# EAGLE design control_driver (EAGLE 7.5.0)
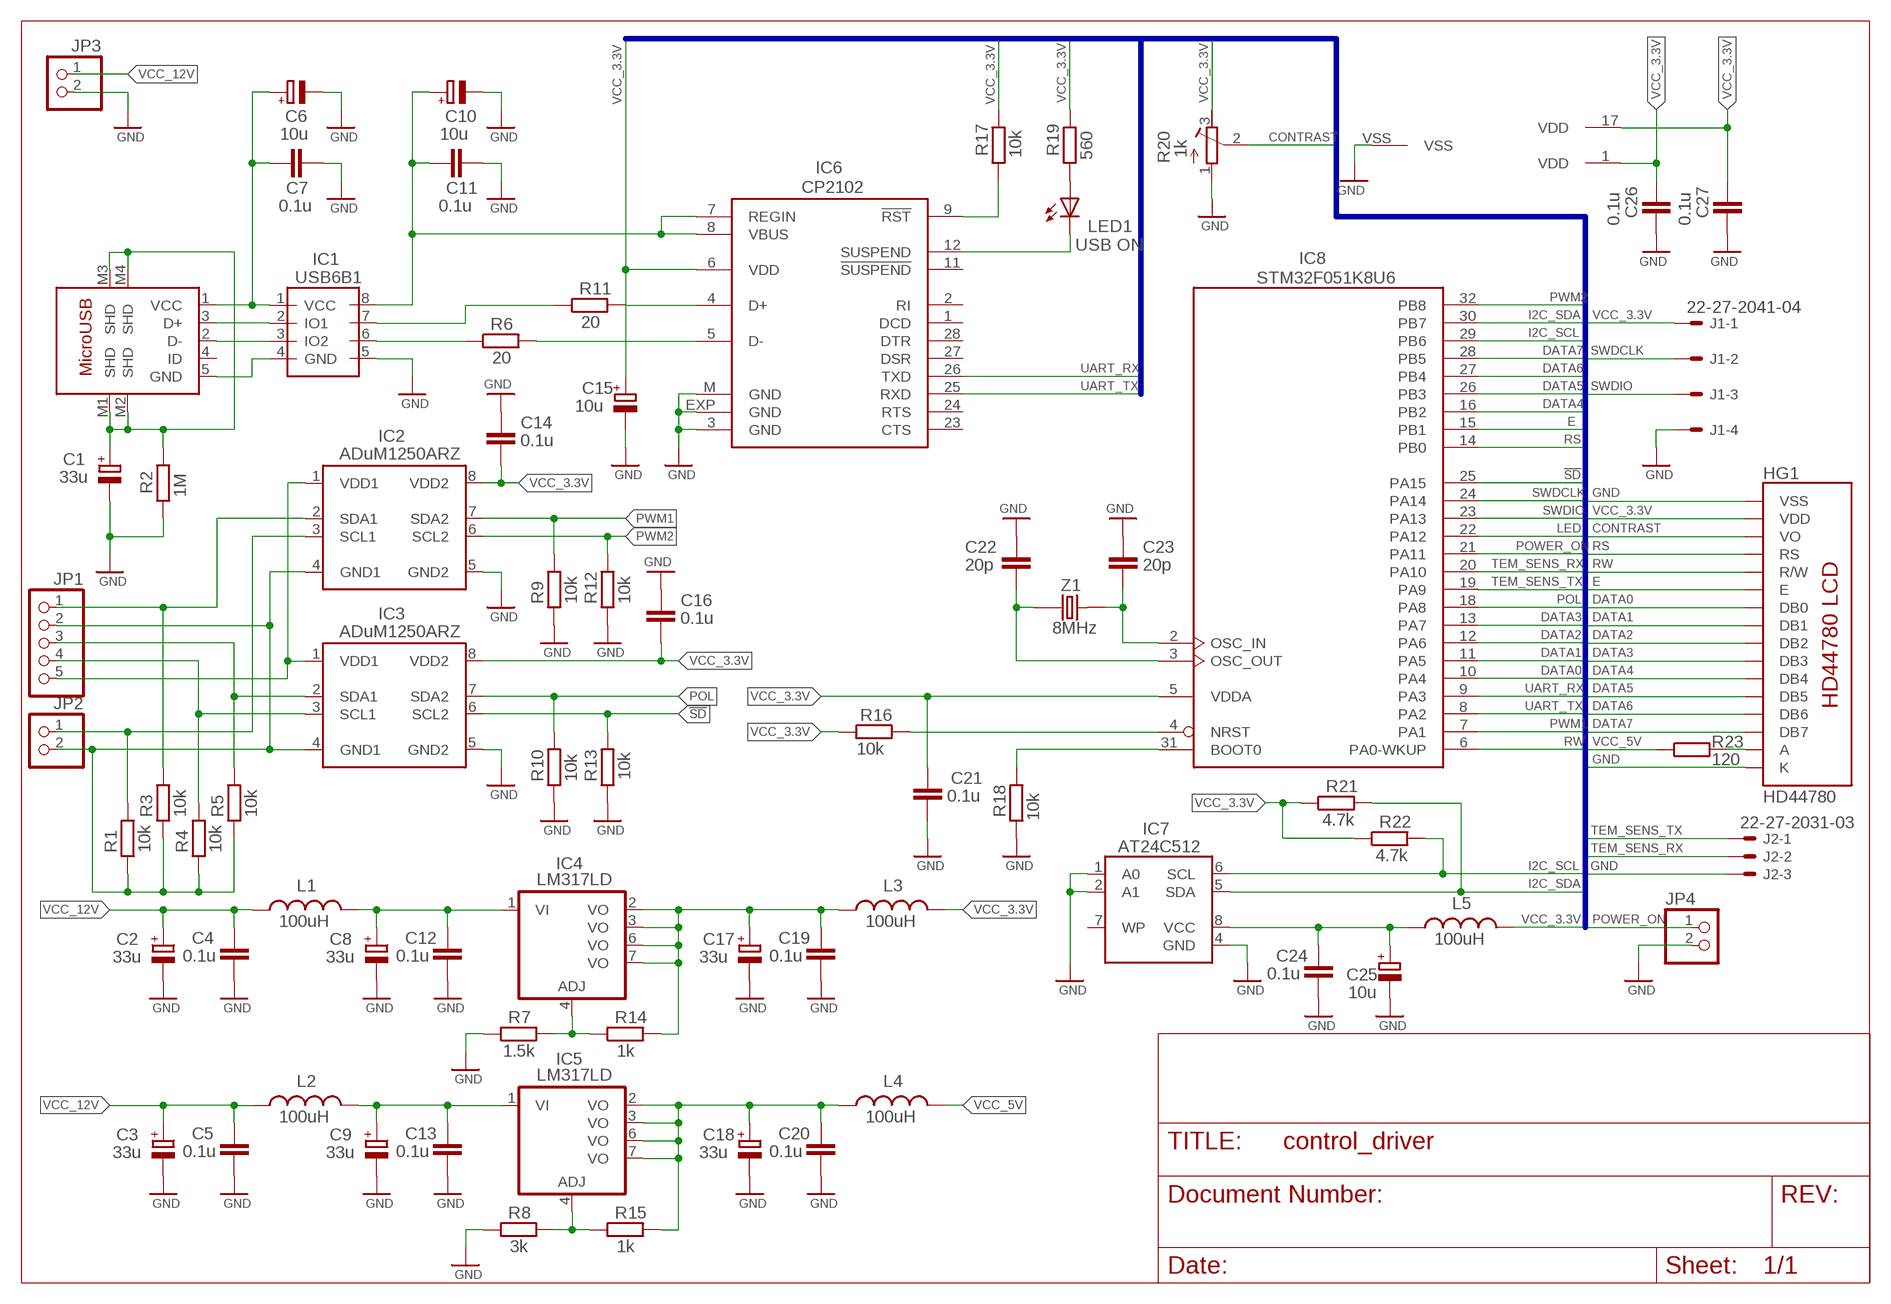
[diagram p0: schematic, sheet 1]

## Parts
C1  33u  CPOL-EUSMCB  [SMC_B]
C2  33u  CPOL-EUSMCC  [SMC_C]
C3  33u  CPOL-EUSMCC  [SMC_C]
C4  0.1u  C-EUC0603  [C0603]
C5  0.1u  C-EUC0603  [C0603]
C6  10u  CPOL-EUSMCA  [SMC_A]
C7  0.1u  C-EUC0603  [C0603]
C8  33u  CPOL-EUSMCC  [SMC_C]
C9  33u  CPOL-EUSMCC  [SMC_C]
C10  10u  CPOL-EUSMCA  [SMC_A]
C11  0.1u  C-EUC0603  [C0603]
C12  0.1u  C-EUC0603  [C0603]
C13  0.1u  C-EUC0603  [C0603]
C14  0.1u  C-EUC0603  [C0603]
C15  10u  CPOL-EUSMCA  [SMC_A]
C16  0.1u  C-EUC0603  [C0603]
C17  33u  CPOL-EUSMCB  [SMC_B]
C18  33u  CPOL-EUSMCB  [SMC_B]
C19  0.1u  C-EUC0603  [C0603]
C20  0.1u  C-EUC0603  [C0603]
C21  0.1u  C-EUC0603  [C0603]
C22  20p  C-EUC0603  [C0603]
C23  20p  C-EUC0603  [C0603]
C24  0.1u  C-EUC0603  [C0603]
C25  10u  CPOL-EUSMCA  [SMC_A]
C26  0.1u  C-EUC0603  [C0603]
C27  0.1u  C-EUC0603  [C0603]
HG1  HD44780  LCD-HD447804-HOLES16X2-4-HOLES  [LCD-16X2-4HOLES]
IC1  USB6B1  [SO08]
IC2  ADuM1250ARZ  ADUM1250  [SO8]
IC3  ADuM1250ARZ  ADUM1250  [SO8]
IC4  LM317LD  [SO08]
IC5  LM317LD  [SO08]
IC6  CP2102  [MLP28]
IC7  AT24C512  24C512  [SO8]
IC8  STM32F051K8U6  STM32F051K8U  [UFQFPN32]
J1  22-27-2041-04  [6410-04]
J2  22-27-2031-03  [6410-03]
JP1  PINHD-1X55X2MM  [1_05X2MM]
JP2  PINHD-1X2  [1X02]
JP3  PINHD-1X2  [1X02]
JP4  PINHD-1X2  [1X02]
L1  100uH  L-US  [C0603]
L2  100uH  L-US  [C0603]
L3  100uH  L-US  [C0603]
L4  100uH  L-US  [C0603]
L5  100uH  L-US  [C0603]
LED1  USB ON  LEDCHIPLED_0805  [CHIPLED_0805]
R1  10k  R-EU_R0603  [R0603]
R2  1M  R-EU_R0603  [R0603]
R3  10k  R-EU_R0603  [R0603]
R4  10k  R-EU_R0603  [R0603]
R5  10k  R-EU_R0603  [R0603]
R6  20  R-EU_R0603  [R0603]
R7  1.5k  R-EU_R0603  [R0603]
R8  3k  R-EU_R0603  [R0603]
R9  10k  R-EU_R0603  [R0603]
R10  10k  R-EU_R0603  [R0603]
R11  20  R-EU_R0603  [R0603]
R12  10k  R-EU_R0603  [R0603]
R13  10k  R-EU_R0603  [R0603]
R14  1k  R-EU_R0603  [R0603]
R15  1k  R-EU_R0603  [R0603]
R16  10k  R-EU_R0603  [R0603]
R17  10k  R-EU_R0603  [R0603]
R18  10k  R-EU_R0603  [R0603]
R19  560  R-EU_R0603  [R0603]
R20  1k  R-TRIMM4G/J  [RTRIM4G/J]
R21  4.7k  R-EU_R0603  [R0603]
R22  4.7k  R-EU_R0603  [R0603]
R23  120  R-EU_R0805  [R0805]
X1  MICRO-USB  [ZX62R-B-5P]
Z1  8MHz  CRYSTAL_5X7MM  [CRYSTAL_5X7]

## Nets
!SD: IC3.6(SCL2) IC8.25(PA15) R13.2
CONTRAST: HG1.3(VO) R20.2(S)
DATA0: HG1.7(DB0) IC8.10(PA4)
DATA1: HG1.8(DB1) IC8.11(PA5)
DATA2: HG1.9(DB2) IC8.12(PA6)
DATA3: HG1.10(DB3) IC8.13(PA7)
DATA4: HG1.11(DB4) IC8.16(PB2)
DATA5: HG1.12(DB5) IC8.26(PB3)
DATA6: HG1.13(DB6) IC8.27(PB4)
DATA7: HG1.14(DB7) IC8.28(PB5)
E: HG1.6(E) IC8.15(PB1)
GND: C1.- C2.- C3.- C4.1 C5.1 C6.- C7.2 C8.- C9.- C10.- C11.2 C12.1 C13.1 C14.2 C15.- C16.2 C17.- C18.- C19.1 C20.1 C21.1 C22.2 C23.2 C24.1 C25.- C26.1 C27.1 HG1.1(VSS) HG1.16(K) IC1.5(GND) IC2.5(GND2) IC3.5(GND2) IC6.3(GND) IC6.EXP(GND) IC6.M(GND) IC7.1(A0) IC7.2(A1) IC7.4(GND) IC8.VSS J1.4 J2.3 JP3.2 JP4.2 R2.1 R7.1 R8.1 R9.1 R10.1 R12.1 R13.1 R18.1 R20.1(A)
I2C_SCL: IC7.6(SCL) IC8.29(PB6) R22.2
I2C_SDA: IC7.5(SDA) IC8.30(PB7) R21.2
LED: IC8.22(PA12)
N$1: HG1.15(A) R23.2
N$2: IC1.6(IO2) R6.1
N$3: IC1.7(IO1) R11.1
N$4: IC6.5(D-) R6.2
N$5: IC6.4(D+) R11.2
N$6: LED1.A R19.1
N$7: C10.+ C11.1 IC1.8(VCC) IC6.7(REGIN) IC6.8(VBUS)
N$8: IC6.9(!RST) R17.1
N$9: IC6.12(SUSPEND) LED1.C
N$10: IC4.4(ADJ) R7.2 R14.1
N$11: C8.+ C12.2 IC4.1(VI) L1.2
N$12: IC5.4(ADJ) R8.2 R15.1
N$13: C1.+ R2.2 X1.M1(SHD) X1.M2(SHD) X1.M3(SHD) X1.M4(SHD)
N$14: IC1.2(IO1) X1.3(D+)
N$15: IC1.3(IO2) X1.2(D-)
N$16: IC1.4(GND) X1.5(GND)
N$17: C6.+ C7.1 IC1.1(VCC) X1.1(VCC)
N$18: C22.1 IC8.3(OSC_OUT) Z1.P$1
N$19: C23.1 IC8.2(OSC_IN) Z1.P$2
N$20: C24.2 C25.+ IC7.8(VCC) L5.1
N$21: IC8.4(NRST) R16.2
N$24: IC2.1(VDD1) IC3.1(VDD1) JP1.5
N$25: IC8.31(BOOT0) R18.2
N$26: IC2.3(SCL1) JP2.1 R1.2
N$27: IC2.2(SDA1) JP1.1 R3.2
N$28: IC3.2(SDA1) JP1.3 R5.2
N$29: IC3.3(SCL1) JP1.4 R4.2
N$30: IC2.4(GND1) IC3.4(GND1) JP1.2 JP2.2 R1.1 R3.1 R4.1 R5.1
POL: IC3.7(SDA2) IC8.18(PA8) R10.2
POWER_ON: IC8.21(PA11) JP4.1
PWM1: IC2.7(SDA2) IC8.7(PA1) R9.2
PWM2: IC2.6(SCL2) IC8.32(PB8) R12.2
RS: HG1.4(RS) IC8.14(PB0)
RW: HG1.5(R/W) IC8.6(PA0-WKUP)
SWDCLK: IC8.24(PA14) J1.2
SWDIO: IC8.23(PA13) J1.3
TEM_SENS_RX: IC8.20(PA10) J2.2
TEM_SENS_TX: IC8.19(PA9) J2.1
UART_RX: IC6.26(TXD) IC8.9(PA3)
UART_TX: IC6.25(RXD) IC8.8(PA2)
VCC_3.3V: C14.1 C15.+ C16.1 C21.2 C26.2 C27.2 HG1.2(VDD) IC2.8(VDD2) IC3.8(VDD2) IC6.6(VDD) IC8.1(VDD) IC8.5(VDDA) IC8.17(VDD) J1.1 L3.2 L5.2 R16.1 R17.2 R19.2 R20.3(E) R21.1 R22.1
VCC_3.3V1: C18.+ C20.2 IC5.2(VO) IC5.3(VO) IC5.6(VO) IC5.7(VO) L4.1 R15.2
VCC_3.3V2222: C17.+ C19.2 IC4.2(VO) IC4.3(VO) IC4.6(VO) IC4.7(VO) L3.1 R14.2
VCC_5V: L4.2 R23.1
VCC_12V: C2.+ C3.+ C4.2 C5.2 JP3.1 L1.1 L2.1
VCC_12V_IN: C9.+ C13.2 IC5.1(VI) L2.2
Unconnected: IC6.1(DCD) IC6.2(RI) IC6.11(!SUSPEND) IC6.23(CTS) IC6.24(RTS) IC6.27(DSR) IC6.28(DTR) IC7.7(WP) X1.4(ID)

## Buses
DATA0,DATA1,DATA2,DATA3,DATA4,DATA5,DATA6,DATA7,E,RS,RW,UART_TX,UART_RX,SWDIO,SWDCLK,LED1,LED2,LED3,PWM1,PWM2,VCC_3.3V,VCC_5V,GND,!SD,CONTRAST,I2C_SDA,I2C_SCL,LED,POL,TEM_SENS_TX,TEM_SENS_RX,POWER_ON

## Library data of the parts
C1-C3 C6 C8-C10 C15 C17 C18 C25 = rcl:CPOL-EU: POLARIZED CAPACITOR, European symbol
C4 C5 C7 C11-C14 C16 C19-C24 C26 C27 = rcl:C-EU: CAPACITOR, European symbol
HG1 = HD44780LCD:LCD-HD44780
IC1 = st-microelectronics:USB6B1: DATA LINES PROTECTION Source: http://www.st.com/stonline/products/literature/ds/5605.pdf; MPN: USB6B1; OC_FARNELL: 9804358; OC_NEWARK: 26M4750
IC2 IC3 = onega:ADUM1250
IC4 IC5 = linear:LM317LD: LOW CURRENT 1.2 TO 37V ADJUSTABLE VOLTAGE REGULATOR Source: http://pdf.alldatasheet.com
IC6 = silabs:CP210*: Single-Chip USB to UART Bridge Source: www.silabs.com .. CP2101.pdf / cp2102.pdf; MF: FARNELL; MPN: CP2102-GM; OC_FARNELL: 9282130; OC_NEWARK: 30K5635
IC7 = onega:24C512
IC8 = micro-stm_v3:STM32F051K*U: ARM 32-bit Cortex™-M0 CPU 48 MHz maximum frequency 16 to 64 Kbytes of Flash memory 4 to 8 kbytes of SRAM 27 GPIOs 2.0 to 3.6 V application supply
J1 = con-molex:22-?-04: CONNECTOR wire to board 2.54 mm (.1 inch) pitch header; OC_FARNELL: unknown; OC_NEWARK: unknown
J2 = con-molex:22-?-03: CONNECTOR wire to board 2.54 mm (.1 inch) pitch header; OC_FARNELL: unknown; OC_NEWARK: unknown
JP1 = pinhead:PINHD-1X5: PIN HEADER
JP2-JP4 = pinhead:PINHD-1X2: PIN HEADER
L1-L5 = rcl:L-US: INDUCTOR, American symbol
LED1 = led:LED: LED OSRAM: - CHIPLED LG R971, LG N971, LY N971, LG Q971, LY Q971, LO R971, LY R971 LH N974, LH R974 LS Q976, LO Q976, LY Q976 LO Q996 - Hyper CHIPLED LW Q18S LB Q993, LB Q99A, LB R99A - SideLED LS A670, LO A670, LY A670, LG A670, LP A670 LB A673, LV A673, LT A673, LW A673 LH A674 LY A675 LS A676, LA A676, LO A676, LY A676, LW A676 LS A679, LY A679, LG A679 - Hyper Micro SIDELED® LS Y876, LA Y876, LO Y876, LY Y876 LT Y87S - SmartLED LW L88C, LW L88S LB L89C, LB L89S, LG L890 LS L89K, LO L89K, LY L89K LS L896, LA L896, LO L896, LY L896 - TOPLED LS T670, LO T670, LY T670, LG T670, LP T670 LSG T670, LSP T670, LSY T670, LOP T670, LYG T670 LG T671, LOG T671, LSG T671 LB T673, LV T673, LT T673, LW T673 LH T674 LS T676, LA T676, LO T676, LY T676, LB T676, LH T676, LSB T676, LW T676 LB T67C, LV T67C, LT T67C, LS T67K, LO T67K, LY T67K, LW E67C LS E67B, LA E67B, LO E67B, LY E67B, LB E67C, LV E67C, LT E67C LW T67C LS T679, LY T679, LG T679 LS T770, LO T770, LY T770, LG T770, LP T770 LB T773, LV T773, LT T773, LW T773 LH T774 LS E675, LA E675, LY E675, LS T675 LS T776, LA T776, LO T776, LY T776, LB T776 LHGB T686 LT T68C, LB T68C - Hyper Mini TOPLED® LB M676 - Mini TOPLED Santana® LG M470 LS M47K, LO M47K, LY M47K Source: http://www.osram.convergy.de LUXEON: - LUMILED® LXK2-PW12-R00, LXK2-PW12-S00, LXK2-PW14-U00, LXK2-PW14-V00 LXK2-PM12-R00, LXK2-PM12-S00, LXK2-PM14-U00 LXK2-PE12-Q00, LXK2-PE12-R00, LXK2-PE12-S00, LXK2-PE14-T00, LXK2-PE14-U00 LXK2-PB12-K00, LXK2-PB12-L00, LXK2-PB12-M00, LXK2-PB14-N00, LXK2-PB14-P00, LXK2-PB14-Q00 LXK2-PR12-L00, LXK2-PR12-M00, LXK2-PR14-Q00, LXK2-PR14-R00 LXK2-PD12-Q00, LXK2-PD12-R00, LXK2-PD12-S00 LXK2-PH12-R00, LXK2-PH12-S00 LXK2-PL12-P00, LXK2-PL12-Q00, LXK2-PL12-R00 Source: www.luxeon.com KINGBRIGHT: KA-3528ASYC Source: www.kingbright.com
R1-R19 R21-R23 = rcl:R-EU_: RESISTOR, European symbol
R20 = rcl:R-TRIMM: Trimm resistor
X1 = con-hirose:MICRO-USB
Z1 = onega:CRYSTAL_5X7MM

## Board
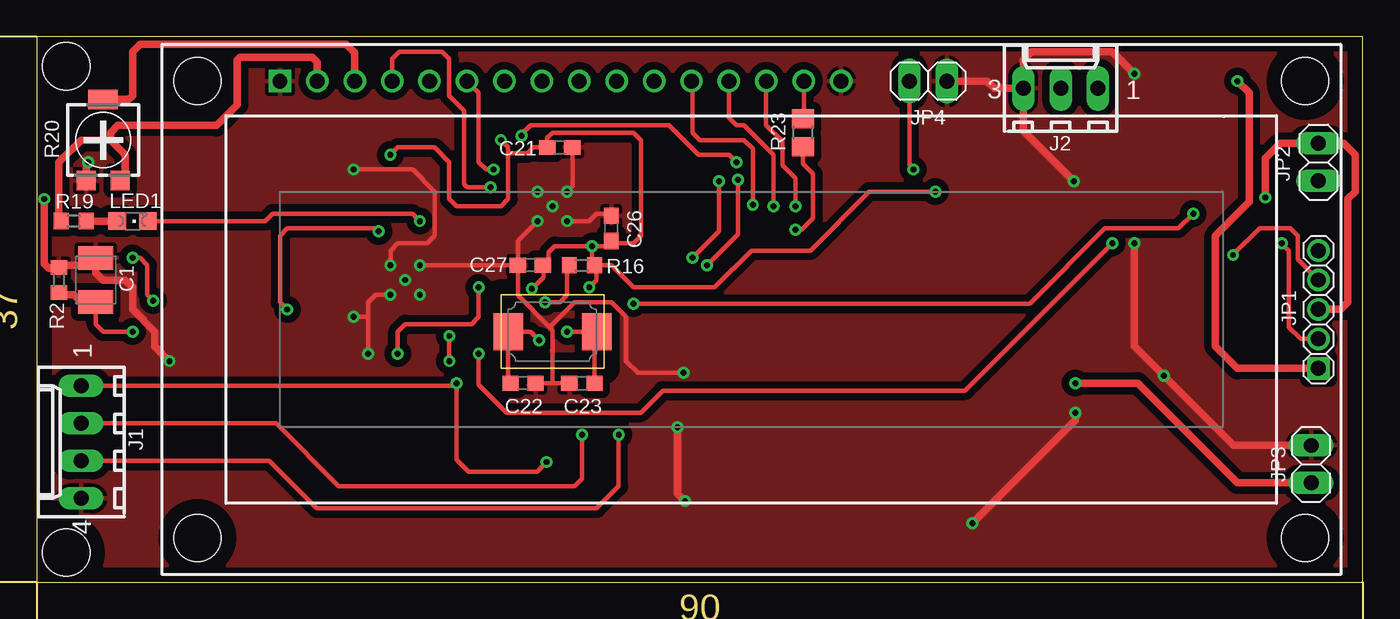
[diagram p1: board, top side]
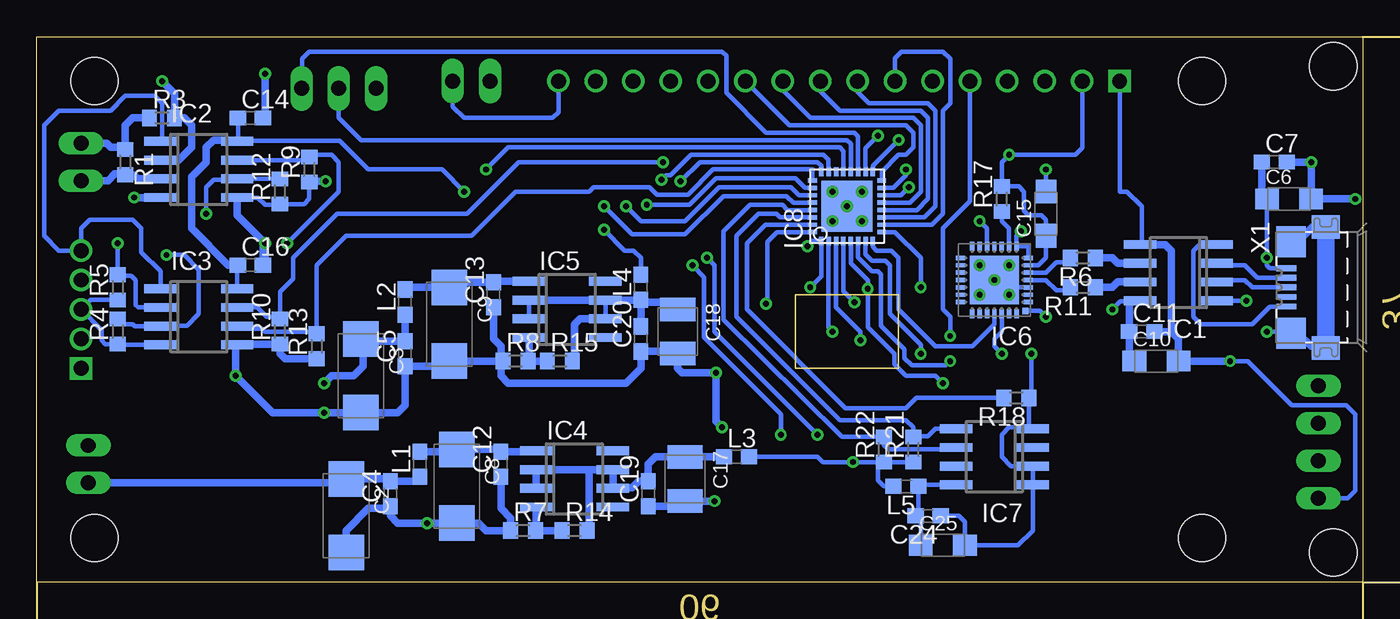
[diagram p2: board, bottom side, seen from below]

Size 90 x 37 mm. Coordinates in mm from the lower left corner, seen from the top.
Outline: 0,0 90,0 90,37 0,37 0,0
Copper layers (1*16): Top 0.035mm / dielectric 1.5mm / Bottom 0.035mm
Design rules "default": minimum track width 10mil, minimum drill 24mil, track to track 8mil, track to pad 8mil, pad to pad 8mil, via to via 8mil, smd to smd 8mil, copper to edge 40mil, drill to drill 8mil, minimum pad ring 10mil, minimum via ring 8mil, stop-mask expansion 4mil, vias tented up to drill 0mil, thermal gap 10mil
Holes 3.2 mm at 2,2 2,35
Milling: area -3.8,35.5 to -3.2,37; area -3.8,0 to -3.2,1.5; area -3.1,17.1 to -1.3,19.9; area 0,-3.3 to 1.5,-2.7; area 88.5,-3.3 to 90,-2.7; area 43.6,-2.6 to 46.4,-0.8; 6 lines

### Footprints (pad centres in the part's own frame; a part is rotated, then mirrored left to right if it is on the bottom)
SMC_B = smd 1.6 x 2.4: + -1.5,0; - 1.5,0
SMC_C = smd 2.4 x 2.4: + -2.5,0; - 2.5,0
C0603 = smd 1.1 x 1: 1 -0.85,0; 2 0.85,0
SMC_A = smd 1.6 x 1.4: + -1.5,0; - 1.5,0
LCD-16X2-4HOLES = drill 1.016 square: 1 -32,15.5 | drill 1.016: 2 -29.46,15.5; 3 -26.92,15.5; 4 -24.38,15.5; 5 -21.84,15.5; 6 -19.3,15.5; 7 -16.76,15.5; 8 -14.22,15.5; 9 -11.68,15.5; 10 -9.14,15.5; 11 -6.6,15.5; 12 -4.06,15.5; 13 -1.52,15.5; 14 1.02,15.5; 15 3.56,15.5; 16 6.1,15.5 | hole 3.2: -37.6,15.5; -37.6,-15.5; 37.6,-15.5; 37.6,15.5
SO08 = smd 0.6 x 2.2: 1 -1.905,-2.6; 2 -0.635,-2.6; 3 0.635,-2.6; 4 1.905,-2.6; 5 1.905,2.6; 6 0.635,2.6; 7 -0.635,2.6; 8 -1.905,2.6
SO8 = smd 0.6 x 2.2: 1 -1.905,-2.6; 2 -0.635,-2.6; 3 0.635,-2.6; 4 1.905,-2.6; 5 1.905,2.6; 6 0.635,2.6; 7 -0.635,2.6; 8 -1.905,2.6
MLP28 = smd 0.6 x 0.3: 1 -2.3,1.5; 2 -2.3,1; 3 -2.3,0.5; 4 -2.3,0; 5 -2.3,-0.5; 6 -2.3,-1; 7 -2.3,-1.5; 15 2.3,-1.5; 16 2.3,-1; 17 2.3,-0.5; 18 2.3,0; 19 2.3,0.5; 20 2.3,1; 21 2.3,1.5 | smd 0.3 x 0.6: 8 -1.5,-2.3; 9 -1,-2.3; 10 -0.5,-2.3; 11 0,-2.3; 12 0.5,-2.3; 13 1,-2.3; 14 1.5,-2.3; 22 1.5,2.3; 23 1,2.3; 24 0.5,2.3; 25 0,2.3; 26 -0.5,2.3; 27 -1,2.3; 28 -1.5,2.3 | smd 3.3 x 3.3: EXP 0,0 | smd 0.435 x 0.435: M -2.103,2.103
UFQFPN32 = smd 0.6 x 0.3: 1 -2.35,1.75; 2 -2.35,1.25; 3 -2.35,0.75; 4 -2.35,0.25; 5 -2.35,-0.25; 6 -2.35,-0.75; 7 -2.35,-1.25; 8 -2.35,-1.75; 17 2.35,-1.75; 18 2.35,-1.25; 19 2.35,-0.75; 20 2.35,-0.25; 21 2.35,0.25; 22 2.35,0.75; 23 2.35,1.25; 24 2.35,1.75 | smd 0.3 x 0.6: 9 -1.75,-2.35; 10 -1.25,-2.35; 11 -0.75,-2.35; 12 -0.25,-2.35; 13 0.25,-2.35; 14 0.75,-2.35; 15 1.25,-2.35; 16 1.75,-2.35; 25 1.75,2.35; 26 1.25,2.35; 27 0.75,2.35; 28 0.25,2.35; 29 -0.25,2.35; 30 -0.75,2.35; 31 -1.25,2.35; 32 -1.75,2.35 | smd 3.45 x 3.45: VSS 0,0
6410-04 = drill 1.016 long: 1 3.81,0; 2 1.27,0; 3 -1.27,0; 4 -3.81,0
6410-03 = drill 1.016 long: 1 2.54,0; 2 0,0; 3 -2.54,0
1_05X2MM = drill 1.016 pad 1.3 square: 1 -4,0 | drill 1.016 pad 1.3: 2 0,0; 3 -2,0; 4 2,0; 5 4,0
1X02 = drill 1.016 long: 1 -1.27,0; 2 1.27,0
CHIPLED_0805 = smd 1.2 x 1.2: A 0,-1.05; C 0,1.05
R0603 = smd 1 x 1.1: 1 -0.85,0; 2 0.85,0
RTRIM4G/J = smd 1.3 x 1.3: 1 -1.15,-2.75; 3 1.15,-2.75 | smd 2 x 1.3: 2 0,2.75
R0805 = smd 1.3 x 1.5: 1 -0.95,0; 2 0.95,0
ZX62R-B-5P = smd 1.35 x 0.4: 1 2.675,-1.3; 2 2.675,-0.65; 3 2.675,0; 4 2.675,0.65; 5 2.675,1.3 | smd 1.9 x 1.6: M1 0,-4.1; M2 0,4.1 | smd 2 x 2.1: M3 2.35,3.1; M4 2.35,-3.1
CRYSTAL_5X7 = smd 2 x 2.5: P$1 -3,0; P$2 3,0

### Placement (x,y rotation side)
C1  4,20.5 90 top
C2  69,4.5 270 bottom
C3  68,14 270 bottom
C4  66,6 90 bottom
C5  65,15.5 90 bottom
C6  5,26 0 bottom
C7  6,28.5 0 bottom
C8  61.5,6.5 270 bottom
C9  62,17.5 270 bottom
C10  14,15 0 bottom
C11  15,17 0 bottom
C12  58.5,8 90 bottom
C13  59,19.5 90 bottom
C14  75.5,31.5 0 bottom
C15  21.5,25 90 bottom
C16  75.5,21.5 0 bottom
C17  46,7 270 bottom
C18  46.5,17 270 bottom
C19  48.5,6 90 bottom
C20  49,16.5 90 bottom
C21  35.5,29.5 180 top
C22  33,13.5 0 top
C23  37,13.5 180 top
C24  29.5,4.5 180 bottom
C25  28.5,2.5 0 bottom
C26  39,24 270 top
C27  33.5,21.5 0 top
HG1  48.5,18.5 0 top
IC1  12.5,21 90 bottom
IC2  79,28 270 bottom
IC3  79,18 270 bottom
IC4  53.5,7 270 bottom
IC5  54,18.5 270 bottom
IC6  25,20.5 180 bottom
IC7  25,8.5 90 bottom
IC8  35,25.5 90 bottom
J1  3,9.5 90 top
J2  69.5,33.5 0 top
JP1  87,18.5 90 top
JP2  87,28.5 90 top
JP3  86.5,8 90 top
JP4  60.5,34 0 top
L1  64,8 90 bottom
L2  65,19 90 bottom
L3  42.5,8.5 0 bottom
L4  49,20 90 bottom
L5  31,6.5 180 bottom
LED1  6.5,24.5 270 top
R1  84,28.5 270 bottom
R2  1.5,20.5 270 top
R3  81.5,31.5 0 bottom
R4  84.5,17 90 bottom
R5  84.5,20 90 bottom
R6  19,22 180 bottom
R7  57,3.5 0 bottom
R8  57.5,15 0 bottom
R9  71.5,28 90 bottom
R10  73.5,17 90 bottom
R11  19,20 180 bottom
R12  73.5,26.5 90 bottom
R13  71,16 90 bottom
R14  53.5,3.5 0 bottom
R15  54.5,15 0 bottom
R16  37,21.5 180 top
R17  24.5,26 90 bottom
R18  23.5,12.5 180 bottom
R19  2.5,24.5 180 top
R20  4.5,30 0 top
R21  30.5,9 90 bottom
R22  32.5,9 90 bottom
R23  52,30.5 90 top
X1  2.5,20 180 bottom
Z1  35,17 0 top

### Tracks (layer width: path | path; a pad name or v marks a point on that pad's centre or on a via)
!SD
  Bottom 0.3: IC8.25 37.35,28 44.1,28 45.8,26.3 47.9,26.3 48.4,26.8 52.2,26.8 52.5,26.5 57.5,26.5 60.5,23.5 69,23.5 71,21.5 R13.2 arc-90 71.15,17 74.5,17 74.7,17.2 76.23,17.2 IC3.6
CONTRAST
  Top 0.5: R20.2 6.25,32.75 6.5,33 6.5,36 7,36.5 21,36.5 21.58,35.92 HG1.3
DATA0
  Bottom 0.3: IC8.10 29.25,24.25 28.5,25 28.5,32 28,32.5 28,35.5 28.5,36 31.3,36 31.74,35.56 HG1.7
DATA1
  Bottom 0.3: IC8.11 29.75,24.75 29,25.5 29,32 29.5,32.5 33.5,32.5 34.28,33.28 HG1.8
DATA2
  Bottom 0.3: IC8.12 30.25,25.25 29.5,26 29.5,31.5 30,32 35.5,32 36.82,33.32 HG1.9
DATA3
  Bottom 0.3: IC8.13 30.75,25.75 30,26.5 30,31 30.5,31.5 37.5,31.5 39.36,33.36 HG1.10
DATA4
  Bottom 0.3: IC8.16 32.65,27.85 31.5,29 31,29 30.5,29.5 30.5,30.5 31,31 38.9,31 HG1.11
DATA5  (via drill 0.4)
  Top 0.3: v48.6,25.6 48.6,29.4 48,30 45,30 44.5,30.5 44.5,33.94 HG1.12
  Bottom 0.3: IC8.26 37.85,26.75 38.5,27.4 43.9,27.4 45.7,25.6 v48.6,25.6
DATA6  (via drill 0.4)
  Top 0.3: v50,25.5 50,29 48,31 47.5,31 47,31.5 47,33.98 HG1.13
  Bottom 0.3: IC8.27 38.25,26.25 38.8,26.8 43.7,26.8 46,24.5 49,24.5 v50,25.5
DATA7  (via drill 0.4)
  Top 0.3: v51.5,25.5 51.5,27.4 50.6,28.3 50.6,29.9 49.5,31 49.5,33.98 HG1.14
  Bottom 0.3: IC8.28 38.65,25.75 39.1,26.2 43.4,26.2 46,23.6 49.6,23.6 v51.5,25.5
E  (via drill 0.4)
  Top 0.3: v31,28 30.5,28 30,28.5 30,33.2 HG1.6
  Bottom 0.3: IC8.15 31.85,26.75 31,27.6 v31,28
GND  (via drill 0.4)
  Top 0.3: C23.2 35,13.5 | 35,13.5 C22.2 | C27.1 32.65,23.15 v34,24.5 | C21.1 36.35,26.85 v36,26.5 | C26.1 38.85,25 38,25 37.5,24.5 v36,24.5 | v26,21.5 C27.1 | C27.1 32.65,19.45 34.8,17.3 | 35,13.5 35,17.1 34.8,17.3 | v21.5,28 25.5,28 27,26.5 27,23.5 26.5,23 24.5,23 24,22.5 v24,21.5 | v24,19.5 23,19.5 22.5,19 22.5,18 | 22.5,18 v22.5,15.5 | v43.9,14.2 40.8,14.2 40,15 40,18 39,19 36.5,19 34.8,17.3 | v21.5,18 22.5,18
  Top 0.5: R20.1 3.35,28.35 v3.5,28.5 | v0.5,26 0.5,21.6 0.8,21.3 1.45,21.3 R2.1 1.85,21.35 2,21.5 3.5,21.5 C1.- 4,21 4.5,20.5 6,20.5 6.5,20 6.5,18.5 8,17 8,16 v9,15 | J2.3 65,33.5 64.5,34 JP4.2 | v70.4,27.2 66.96,30.64 J2.3 | v74.5,34.5 73,36 67.5,36 66.96,35.46 J2.3 | v74.5,23 74.5,16 v76.5,14 81.23,9.27 JP3.2 | v70.5,11.5 70.5,11 v63.5,4 | v43.5,10.5 43.5,6 v44,5.5
  Bottom 0.3: IC6.3 24,20 v24,19.5 IC6.EXP | IC1.5 15,23 15,25.5 16,26.5 16.5,26.5 HG1.1 | C24.1 27.4,4.5 27,4.1 C25.- 23.4,2.5 22.4,3.5 IC7.1 IC7.2 23.86,7.87 24.5,8.5 24.5,10 24,10.5 22.5,10.5 IC7.4 22.65,10.65 R18.1 22.5,12.65 v22.5,15.5 | v34,24.5 IC8.VSS | v36,26.5 IC8.VSS | v36,24.5 IC8.VSS | IC6.EXP v26,21.5 | HG1.16 54.6,31.9 55,31.5 61,31.5 61.77,32.27 JP4.2 | C15.- v21.5,28 | v24,21.5 IC6.EXP | v9,15 7.8,15 4.8,12 1.1,12 0.5,11.4 0.5,6.2 1,5.7 J1.4 | R9.1 71.5,26 71.85,25.65 R12.1 73.55,25.6 74.5,25.6 75,26.09 IC2.5 | IC6.M 21.9,18.4 v21.5,18
  Bottom 0.5: C7.2 v3.5,28.5 C6.- v0.5,26 | v9,15 C10.- 12.5,16.5 13,17 | C11.2 13,17 | IC1.5 13.4,22.91 13,22.5 13,17 | R8.1 58.5,14.85 58.5,14 58,13.5 50,13.5 49,14.5 C20.1 46.65,15.65 C18.- 46.5,14.5 46.2,14.2 v43.9,14.2 43.9,10.9 v43.5,10.5 | C13.1 59,16.5 58.5,16 58.5,15.15 R8.1 | R8.1 C9.- 62.35,14.65 C5.1 65,12 65.5,11.5 C3.- v70.5,11.5 74,11.5 v76.5,14 76.5,15.99 IC3.5 76.34,16.15 R10.1 73.5,15.5 73.15,15.15 R13.1 | C19.1 46.35,5.15 C17.- v44,5.5 | C12.1 58.5,5 57.85,4.35 R7.1 59.5,3.5 60,4 C8.- | 62,4 C8.- | C8.- v63.5,4 65.5,4 66,4.5 C4.1 66.15,5 67.5,5 69,3.5 C2.- | R9.1 71.45,27.2 v70.4,27.2 | C14.2 74.5,31.65 v74.5,34.5 | v74.5,23 74.5,21.65 C16.2 74.65,22.85 v74.5,23 | v74.5,23 76.4,24.9 IC2.5 | v34,26.5 IC8.VSS | v26,19.5 IC6.EXP
  other vias: 25,20.5 35,25.5
  pour Top (isolate 0.5, rank 6): 0,37 90,37 90,0 0,0
I2C_SCL
  Bottom 0.3: IC8.29 39.05,25.25 39.4,25.6 41.6,25.6 43.4,23.8 43.4,17.8 35.35,9.85 R22.2 32.5,9.3 32.2,9 28.2,9 28.07,9.13 IC7.6
I2C_SDA
  Bottom 0.3: IC8.30 39.55,24.75 39.8,25 41,25 42.5,23.5 42.5,18 35.5,11 31,11 30.5,10.5 R21.2 30.45,9.9 29.5,9.9 29,10.4 IC7.5
N$1
  Top 0.3: HG1.15 52.06,31.51 R23.2
N$2
  Bottom 0.5: IC1.6 16.63,21.64 17,22 R6.1
N$3
  Bottom 0.5: IC1.7 16.63,20.36 17,20 R11.1
N$4
  Bottom 0.3: IC6.5 21.5,21 20.8,21.7 20.15,21.7 R6.2
N$5
  Bottom 0.3: IC6.4 21.5,20.5 20.8,19.8 20.05,19.8 R11.2
N$6
  Top 0.5: LED1.A R19.1
N$7  (via drill 0.4)
  Top 0.3: v23.2,23.8 23,24 17,24 16.5,23.5 16.5,19 v17,18.5
  Bottom 0.3: v23.2,23.8 23.5,23.5 IC6.8 22.7,22.8 IC6.7 | v17,18.5 16.45,19.05 15.85,19.05
  Bottom 0.5: IC1.8 15.8,19.1 15.85,19.05 C11.1 15.85,15.35 C10.+
N$8
  Bottom 0.3: IC6.9 24,24 24.5,24.5 R17.1
N$9  (via drill 0.4)
  Top 0.3: v26,24.5 25.5,25 16,25 15.5,24.5 LED1.C
  Bottom 0.3: IC6.12 25.5,24 v26,24.5
N$10
  Bottom 0.5: R14.1 R7.2 56.1,3.55 IC4.4
N$11
  Bottom 0.5: IC4.1 56.16,8.85 C12.2 58.65,9 C8.+ 61.65,8.85 L1.2
N$12
  Bottom 0.5: IC5.4 56.6,15.05 R8.2 R15.1
N$13  (via drill 0.4)
  Top 0.3: v6.5,17 4.5,17 4,17.5 C1.+
  Top 0.5: C1.+ 3,19 2.5,19.5 1.65,19.5 R2.2
  Bottom 0.3: 4.4,16.9 4.5,17 v6.5,17 | 3.5,24 2,24
  Bottom 0.5: X1.M1 3.4,24.1 3.5,24 4.5,23 4.75,23 X1.M4 | X1.M3 4.4,16.9 3.5,16 2.6,16 X1.M2
  Bottom 1.2: X1.M2 X1.M1
N$14
  Bottom 0.3: X1.3 7.5,20 8,20.5 9.77,20.5 IC1.2
N$15
  Bottom 0.3: X1.2 7.15,20.65 8,21.5 9.77,21.5 IC1.3
N$16
  Bottom 0.3: IC1.4 11.1,22.91 11.5,22.5 11.5,18 11,17.5 7.5,17.5 6.3,18.7 X1.5
N$17  (via drill 0.4)
  Top 0.3: v7.9,19.1 7.5,19.5 7.5,21.5 7,22 v6.5,22
  Bottom 0.3: X1.1 6.3,21.3 6.5,21.5 v6.5,22 C6.+ | IC1.1 v7.91,19.09 v7.9,19.1
  Bottom 0.5: C6.+ 6.85,26.35 C7.1
N$18  (via drill 0.4)
  Top 0.3: C22.1 32,13.65 Z1.P$1 33.5,17 v34.1,16.4
  Bottom 0.3: IC8.3 35.75,18.65 34.1,17 v34.1,16.4
N$19  (via drill 0.4)
  Top 0.3: C23.1 37.85,16.85 Z1.P$2 v36,17
  Bottom 0.3: v36,17 36.25,17.25 IC8.2
N$20
  Bottom 0.3: IC7.8 30.05,6.59 L5.1 30.15,4.7 C24.2 30,4.15 C25.+
N$21  (via drill 0.4)
  Top 0.3: v34.5,19 35.5,19 36,19.5 36,21.35 R16.2
  Bottom 0.3: IC8.4 35.25,19.75 v34.5,19
N$24
  Bottom 0.3: IC2.1 81.5,30 81.5,32.5 82,33 84,33 85,32 88.5,32 89.5,31 89.5,23.5 88.5,22.5 JP1.5 87,24 86.4,24.6 83.5,24.6 82.9,24 82.9,22.4 81.6,21.1 IC3.1
N$25
  Bottom 0.3: IC8.31 40.55,24.25 41.8,23 41.8,18.5 35.1,11.8 31,11.8 30.3,12.5 R18.2
N$26
  Bottom 0.5: IC2.3 83.17,27.36 83.4,27.6 83.95,27.6 R1.2 84.05,27.7 84.7,27.7 85.17,27.23 JP2.1
N$27  (via drill 0.4)  (1 unrouted)
  Top 0.5: JP1.1 81.5,14.5 80,16 80,23.5 82.3,25.8 82.3,33.2 v81.5,34
  Bottom 0.5: IC2.2 80.36,28.64 79.5,29.5 79.5,31 80,31.5 80.5,31.5 | v81.5,34 80.65,33.15 R3.2
N$28  (via drill 0.4)
  Top 0.3: JP1.3 85.8,16.5 85,17.3 85,22.5 v84.5,23
  Bottom 0.3: IC3.2 83.14,18.64 83.3,18.8 83.3,20.5 83.6,20.8 84.45,20.8 R5.2 v84.5,23
N$29  (via drill 0.4)
  Top 0.3: v81.2,22.2 83,24 85.1,24 85.6,23.5 85.6,21.9 JP1.4
  Bottom 0.3: R4.2 84.15,17.5 83.5,17.5 83.36,17.36 IC3.3 81.56,17.4 79.8,17.4 79,18.2 79,21.2 80,22.2 v81.2,22.2
N$30  (via drill 0.4)
  Top 0.5: JP1.2 88.5,18.5 89,19 89,26 89.5,26.5 89.5,29 88.73,29.77 JP2.2 84.42,29.77 83.4,28.75 v83.4,26.1
  Bottom 0.3: R5.1 86.35,19.15 JP1.2 85.6,17.1 85.6,16.4 85.35,16.15 R4.1 84.44,16.09 IC3.4
  Bottom 0.5: R3.1 83.5,31.5 84,31 R1.1 84.15,29.5 85,29.5 85.27,29.77 JP2.2 | IC2.4 v83.39,26.09 arc90 v83.4,26.1
POL  (via drill 0.4)
  Top 0.3: v32.9,30.3 32.9,30.4 33.5,31 42.9,31 44.9,29 47,29 v47.5,28.5
  Bottom 0.3: IC8.18 33.75,29.45 v32.9,30.3 | v47.5,28.5 57.3,28.5 60.8,25 69.6,25 72.6,22 72.6,20.6 73.5,19.7 R10.2 73.65,18 74.4,18 75.03,18.64 IC3.7
POWER_ON  (via drill 0.4)
  Top 0.3: v59.5,28 59.23,28.27 JP4.1
  Bottom 0.3: IC8.21 35.25,29.25 35.5,29.5 58,29.5 v59.5,28
PWM1  (via drill 0.4)
  Top 0.3: v30,15.5 30,13.4 31.9,11.5 41,11.5 42.5,13 63,13 v73,23
  Bottom 0.3: IC8.7 33.75,22.25 33.3,21.8 32.4,21.8 32.1,21.5 32.1,18.2 30,16.1 v30,15.5 | v73,23 69.5,26.5 69.5,28.5 70,29 71.35,29 R9.2 71.72,28.64 IC2.7
PWM2  (via drill 0.4)
  Top 0.3: v40.5,18.9 67.4,18.9 72.5,24 77.5,24 v78.5,25
  Bottom 0.3: IC8.32 39.75,23.75 40.4,23.1 40.4,19 v40.5,18.9 | v78.5,25 78.5,26.8 78,27.3 76.47,27.3 IC2.6 73.52,27.36 R12.2
RS  (via drill 0.4)
  Top 0.3: v30.8,26.8 29.2,26.8 29,27 29,32 28,33 28,35.5 27.5,36 24.6,36 24.12,35.52 HG1.4
  Bottom 0.3: IC8.14 31.35,26.25 v30.8,26.8
RW  (via drill 0.4)
  Top 0.3: v28,15 v28,16.7
  Bottom 0.3: IC8.6 34.25,22.05 33.3,21.1 32.9,21.1 32.7,20.9 32.7,17.4 31.1,15.8 31.1,15.2 30.6,14.7 28.3,14.7 v28,15 | v28,16.7 28,18 28.5,18.5 28.5,24 26.66,25.84 HG1.5
SWDCLK  (via drill 0.4)
  Top 0.3: v46.3,27.2 46.3,23.8 v44.5,22 | v37,10 37,7 36.5,6.5 20.5,6.5 16.23,10.77 J1.2
  Bottom 0.3: IC8.24 36.75,28.25 37,28.5 45,28.5 v46.3,27.2 | v44.5,22 44,21.5 44,17 v37,10
SWDIO  (via drill 0.4)
  Top 0.3: v47.6,27.3 47.6,23.6 v45.5,21.5 | J1.3 15.77,8.23 19,5 38,5 39.5,6.5 v39.5,10
  Bottom 0.3: IC8.23 36.25,28.65 36.6,29 45.6,29 47,27.6 47.3,27.6 v47.6,27.3 | v39.5,10 39.5,11.4 44.7,16.6 44.7,20.7 v45.5,21.5
TEM_SENS_RX
  Bottom 0.3: IC8.20 34.75,29.75 35,30 68,30 69.5,31.5 J2.2
TEM_SENS_TX
  Bottom 0.3: IC8.19 34.25,30.25 34.5,30.5 40.5,30.5 43.2,33.2 43.2,35.7 43.5,36 71.5,36 72,35.5 72,33.54 J2.1
UART_RX  (via drill 0.4)
  Top 0.3: v24.5,15.5 24.5,17 25,17.5 29.5,17.5 30,18 v30,20
  Bottom 0.3: IC6.26 24.5,17 25,16.5 25,16 v24.5,15.5 | v30,20 30,22 31.75,23.75 IC8.9
UART_TX
  Bottom 0.3: IC8.8 33.25,22.75 33,22.5 32,22.5 31.5,22 31.5,18.5 29,16 26.5,16 25,17.5 IC6.25
VCC_3.3V  (via drill 0.4)
  Top 0.3: 34.4,21.45 C27.2 | v37.7,22.8 38.65,22.8 C26.2 39.15,23 40.5,23 41,23.5 41,30 40.5,30.5 35,30.5 34.65,30.15 C21.2 33.7,29.5 33.3,29.1 32,29.1 | R16.1 37.7,21.65 v37.7,22.8 | v34.6,8.15 33.95,7.5 29.3,7.5 28.5,8.3 v28.5,13.5 28.31,13.31 J1.1 | v24,29 24.5,29.5 27,29.5 28,28.5 28,26 28.5,25.5 31.5,25.5 32,26 32,29.1 | 32,29.1 32,29.5 v31.5,30 | v61,26.5 56.5,26.5 52.5,22.5 48.5,22.5 46,20 40.5,20 39,21.5 38,21.5 | 38,21.5 R16.1 | v37.5,20 38,20.5 38,21.5 | 37.5,21.5 R16.1 | 34.4,21.45 34.75,21.8 34.75,22.4 35.15,22.8 v37.7,22.8 | 34.4,21.45 34.4,20.7 v33.6,19.9
  Top 0.5: R19.2 1.5,24.5 1.5,28.5 3,30 5,30 | 5,30 6,29 6,27.6 R20.3 | HG1.2 19.04,35.26 18.7,35.6 13.8,35.6 13.6,35.4 13.6,32.4 12.2,31 5.5,31 5,30.5 5,30
  Bottom 0.3: IC6.6 22,21.5 21.5,22 C15.+ 21.5,24.6 21.8,24.9 22.7,24.9 23,25.2 23,26.5 23.35,26.85 R17.2 24.5,28.5 v24,29 19.5,29 19.04,29.46 HG1.2 | R22.1 R21.1 | L5.2 32.5,6.5 32.9,6.9 32.9,7.75 R22.1 | R22.1 v34.6,8.15 36.65,8.15 37,8.5 L3.2 | IC8.17 33.25,28.25 v31.5,30 | IC8.5 34.75,21.65 33.6,20.5 v33.6,19.9 33.6,17.3 31.8,15.5 31.8,14.8 31,14 29,14 v28.5,13.5 | v37.7,22.8 37.35,23.15 IC8.1 36.75,20.75 v37.5,20 | C14.1 76.35,29.95 | 76.35,29.95 IC2.8 76.5,30 | IC3.8 76.4,21.45 C16.1 | 76.35,29.95 69.45,29.95 67.5,28 62.5,28 v61,26.5
  Bottom 0.5: 76.5,30 78,30 78.5,29.5 78.5,28.5 79.5,27.5 79.5,24 77,21.5 C16.1
VCC_3.3V1
  Bottom 0.3: IC5.7 IC5.6 | IC5.2 IC5.3
  Bottom 0.5: L4.1 C20.2 | C18.+ 47,19 48.85,19 L4.1 | IC5.2 IC5.7 49.02,19.14 L4.1 | IC5.6 53.13,17.86 53.5,17.5 53.5,15.15 R15.2
VCC_3.3V2222
  Bottom 0.5: 52.5,7.63 IC4.7 IC4.6 50.87,6.4 49.6,6.4 49.15,6.85 C19.2 48.5,8 48,8.5 C17.+ L3.1 | 52.5,7.63 IC4.2 IC4.3 | R14.2 52.5,3.65 52.5,7.63
VCC_5V  (via drill 0.4)
  Top 0.3: R23.1 52,28.4 52.7,27.7 52.7,24.7 51.9,23.9 v51.5,23.9
  Bottom 0.3: v51.5,23.9 50.1,22.5 49.5,22.5 49,22 L4.2
VCC_12V  (via drill 0.4)
  Top 0.5: v70.5,13.5 74.73,13.5 81.5,6.73 JP3.1
  Bottom 0.5: L2.1 C5.2 67.5,16.35 67.85,16 | C3.+ 67.85,16.35 67.85,16 | L1.1 64.3,6.85 C4.2 66.15,7 C2.+ 69.27,6.73 JP3.1 | 67.85,16 67.85,14.65 68.5,14 70,14 v70.5,13.5
VCC_12V_IN
  Bottom 0.5: IC5.1 58.95,20.41 C13.2 61.65,20.35 C9.+ 64.85,20 L2.2